# EAGLE design uno_bt (EAGLE 9.5.0)
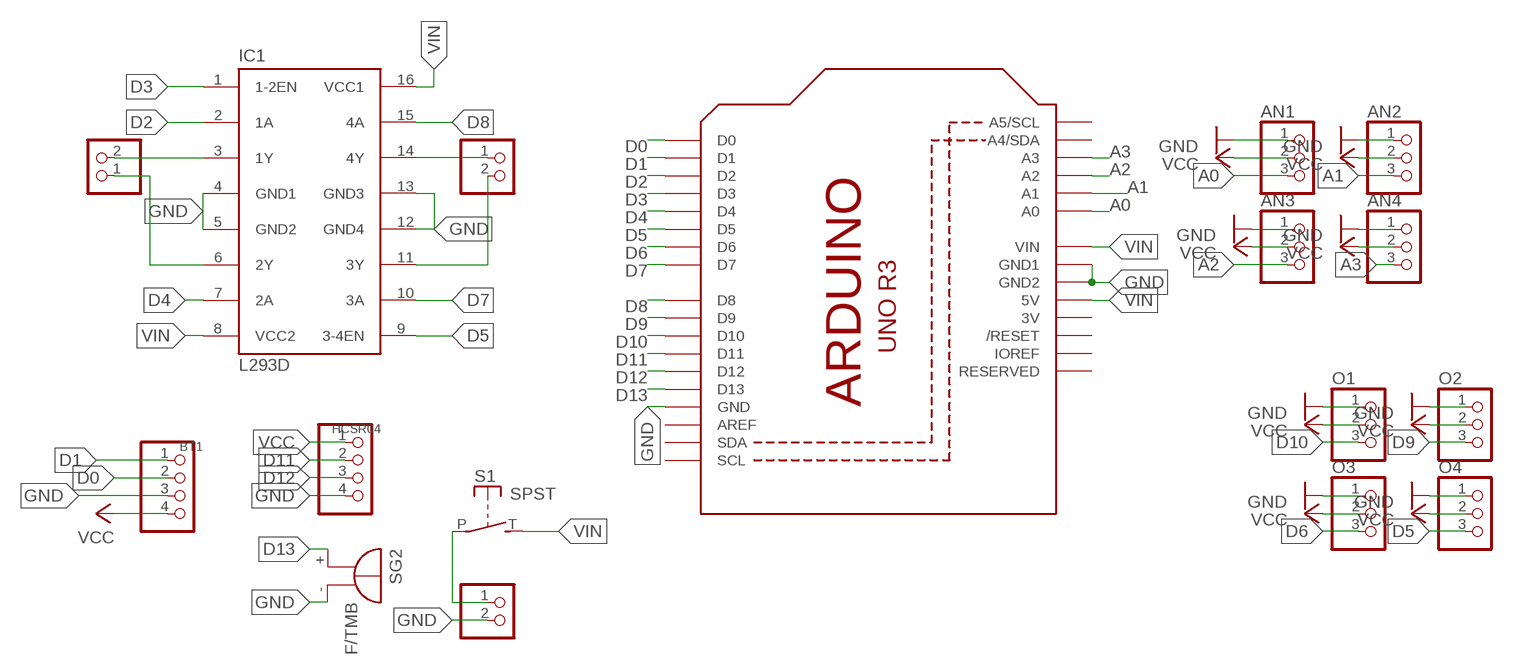
[diagram p0: schematic, sheet 1]

## Parts
AN1  PINHD-1X3  [1X03]
AN2  PINHD-1X3  [1X03]
AN3  PINHD-1X3  [1X03]
AN4  PINHD-1X3  [1X03]
BT1  PINHD-1X4  [1X04]
DCIN  PINHD-1X2  [1X02]
HCSR04  PINHD-1X4  [1X04]
IC1  L293D  [DIL16]
MT1  PINHD-1X2  [1X02]
MT2  PINHD-1X2  [1X02]
O1  PINHD-1X3  [1X03]
O2  PINHD-1X3  [1X03]
O3  PINHD-1X3  [1X03]
O4  PINHD-1X3  [1X03]
S1  SPST  [JUDCOSPST]
SG2  F/TMB  [F/TMB]
U1  ARDUINOR3-BPLACE  [ARDUINOR3-BPLACE]

## Nets
A0: AN1.3 U1.A0
A1: AN2.3 U1.A1
A2: AN3.3 U1.A2
A3: AN4.3 U1.A3
D0: BT1.2 U1.D0
D1: BT1.1 U1.D1
D2: IC1.2(1A) U1.D2
D3: IC1.1(1-2EN) U1.D3
D4: IC1.7(2A) U1.D4
D5: IC1.9(3-4EN) O4.3 U1.D5
D6: O3.3 U1.D6
D7: IC1.10(3A) U1.D7
D8: IC1.15(4A) U1.D8
D9: O2.3 U1.D9
D10: O1.3 U1.D10
D11: HCSR04.2 U1.D11
D12: HCSR04.3 U1.D12
D13: SG2.+ U1.D13
GND: AN1.1 AN2.1 AN3.1 AN4.1 BT1.3 DCIN.2 HCSR04.4 IC1.4(GND1) IC1.5(GND2) IC1.12(GND4) IC1.13(GND3) O1.1 O2.1 O3.1 O4.1 SG2.- U1.GND U1.GND1 U1.GND2
N$1: IC1.3(1Y) MT1.2
N$2: IC1.6(2Y) MT1.1
N$3: IC1.14(4Y) MT2.1
N$4: IC1.11(3Y) MT2.2
N$5: DCIN.1 S1.P
VCC: AN1.2 AN2.2 AN3.2 AN4.2 BT1.4 HCSR04.1 O1.2 O2.2 O3.2 O4.2
VIN: IC1.8(VCC2) IC1.16(VCC1) S1.T(S) U1.5V U1.VIN
Unconnected: U1.A4(A4/SDA) U1.A5(A5/SCL) U1.AREF U1.IOREF U1.RESERVED U1.RESET(/RESET) U1.SCL U1.SDA

## Power pins joined to a net without a drawn wire
3V: U1.3V

## Library data of the parts
AN1-AN4 O1-O4 = adafruit:PINHD-1X3: PIN HEADER
BT1 HCSR04 = pinhead:PINHD-1X4: PIN HEADER
DCIN MT1 MT2 = pinhead:PINHD-1X2: PIN HEADER
IC1 = st-microelectronics:L293D: PUSH-PULL 4 CHANNEL DRIVER; MPN: L293D; OC_FARNELL: 9589619; OC_NEWARK: 56P8249
S1 = adafruit_arduino:SPST: Judco 50-0015-00
SG2 = buzzer:F/TMB: BUZZER Source: Buerklin; OC_FARNELL: unknown; OC_NEWARK: unknown
U1 = adafruit_arduino:ARDUINOR3: This is a new object for the new Arduino R3 - with extra pins that you may want to use (such as IOref, and duplicated A4/A5

## Board
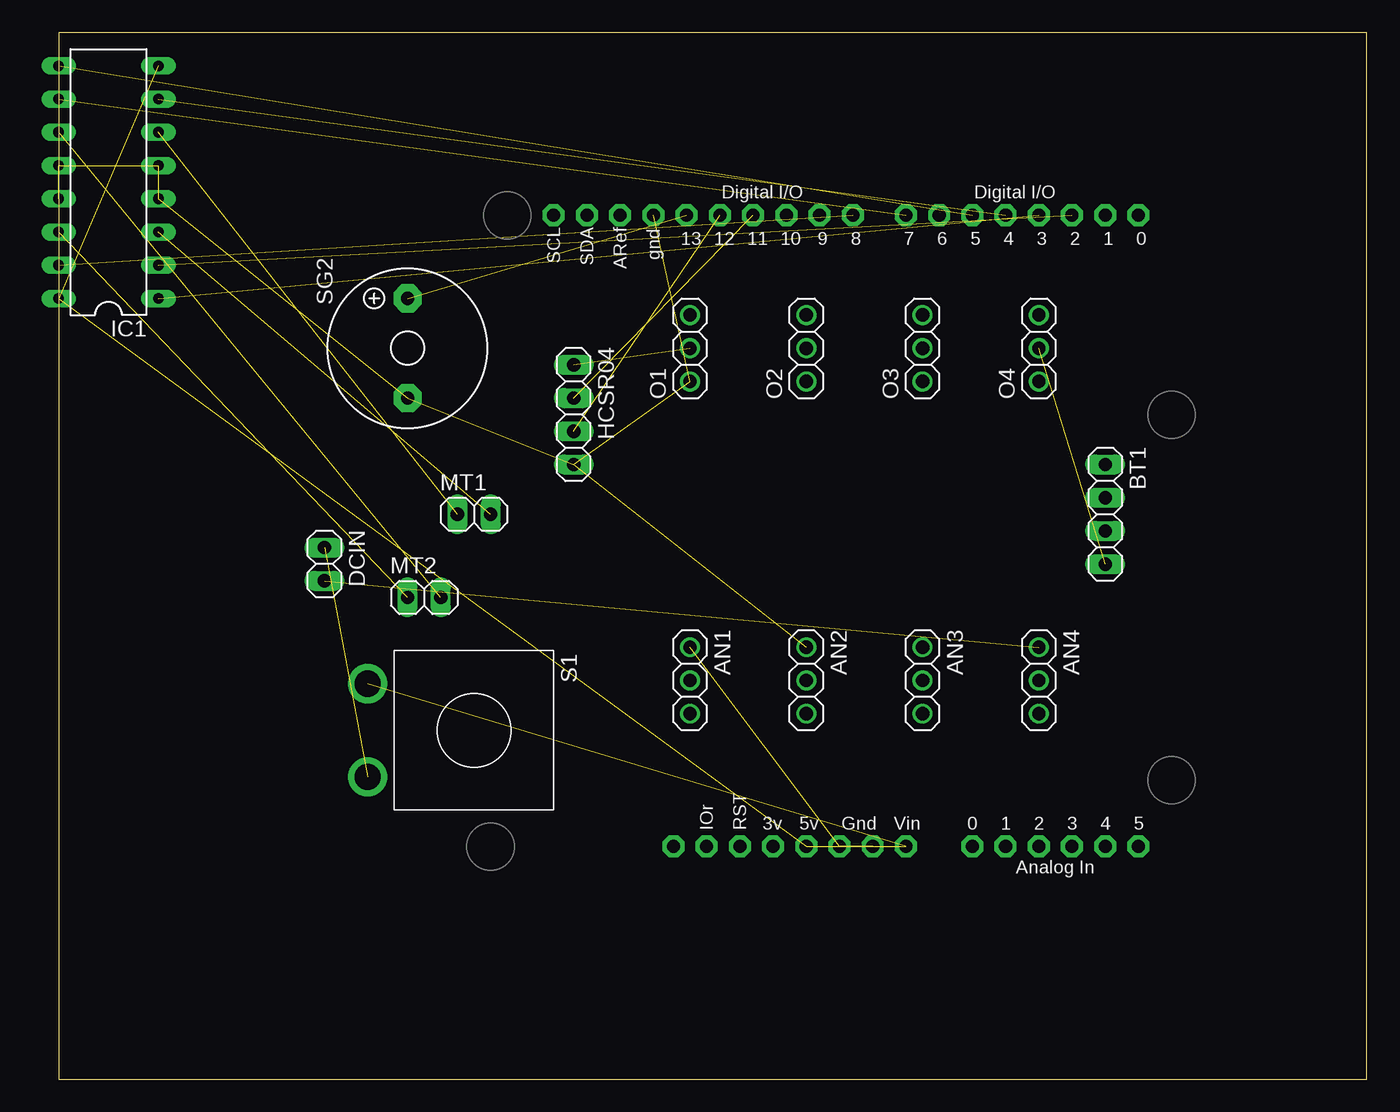
[diagram p1: board, top side]
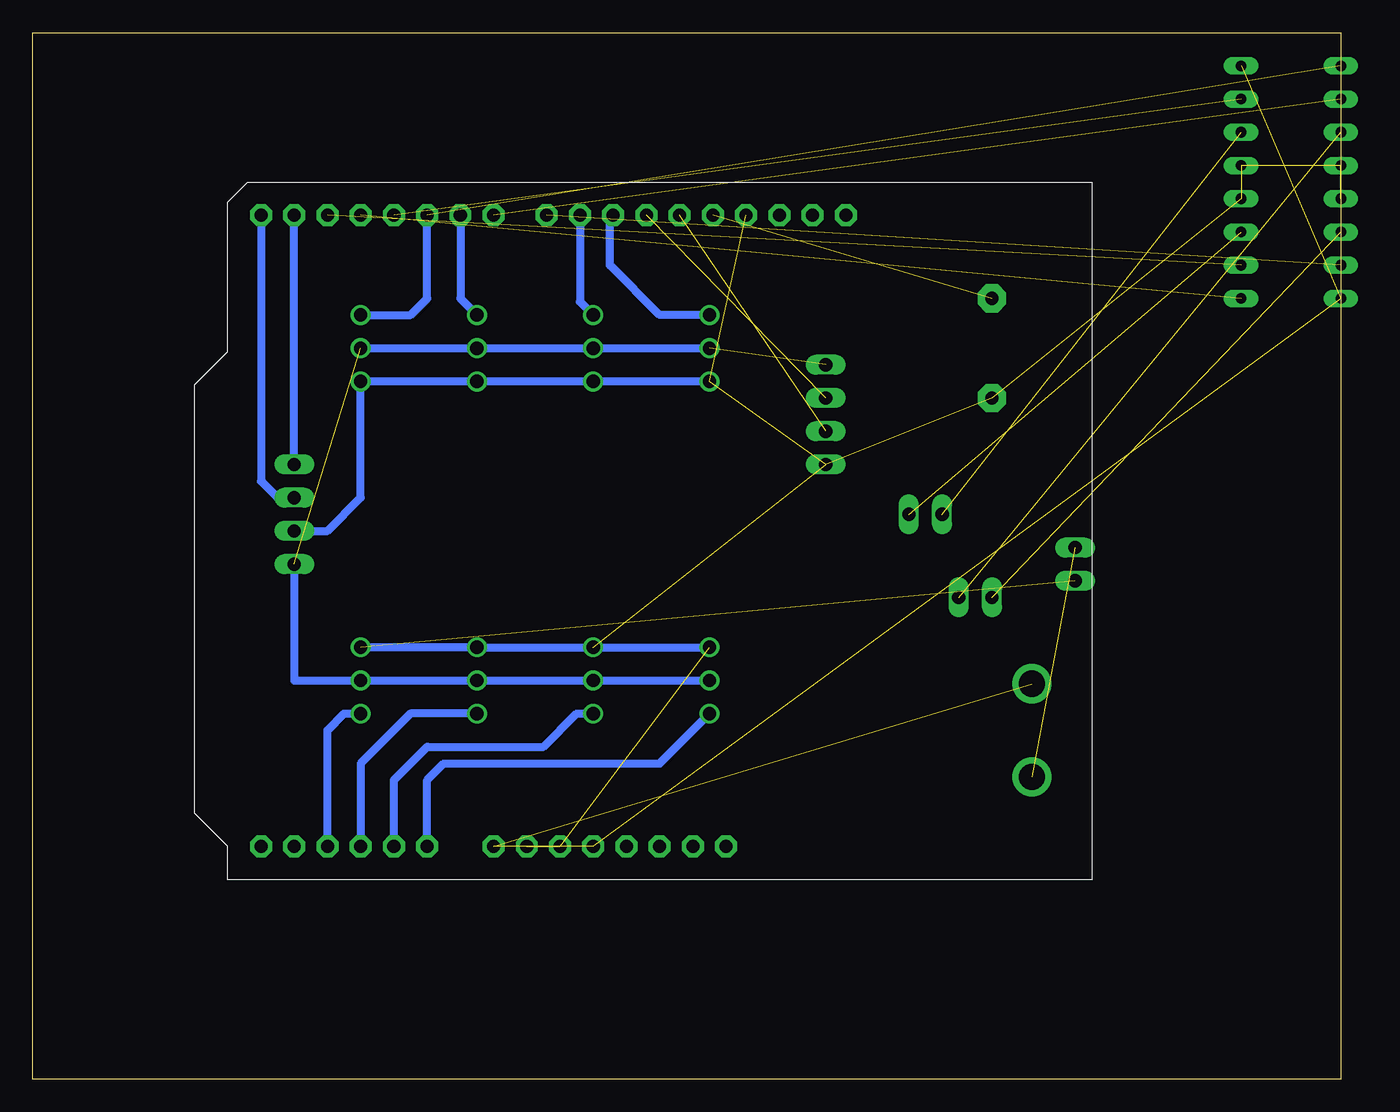
[diagram p2: board, bottom side, seen from below]

Size 100 x 80 mm. Coordinates in mm from the lower left corner, seen from the top.
Outline: 0,0 100,0 100,80 0,80 0,0
Copper layers (1*16): Top 0.035mm / dielectric 1.5mm / Bottom 0.035mm
Design rules "default": minimum track width 6mil, minimum drill 0.35mm, track to track 6mil, track to pad 6mil, pad to pad 6mil, via to via 6mil, smd to smd 6mil, copper to edge 40mil, drill to drill 6mil, minimum pad ring 10mil, minimum via ring 8mil, stop-mask expansion 4mil, vias tented up to drill 0mil, thermal gap 10mil

### Footprints (pad centres in the part's own frame; a part is rotated, then mirrored left to right if it is on the bottom)
1X03 = drill 1.016: 1 -2.54,0; 2 0,0; 3 2.54,0
1X04 = drill 1.016 long: 1 -3.81,0; 2 -1.27,0; 3 1.27,0; 4 3.81,0
1X02 = drill 1.016 long: 1 -1.27,0; 2 1.27,0
DIL16 = drill 0.813 long: 1 -8.89,-3.81; 2 -6.35,-3.81; 3 -3.81,-3.81; 4 -1.27,-3.81; 5 1.27,-3.81; 6 3.81,-3.81; 7 6.35,-3.81; 8 8.89,-3.81; 9 8.89,3.81; 10 6.35,3.81; 11 3.81,3.81; 12 1.27,3.81; 13 -1.27,3.81; 14 -3.81,3.81; 15 -6.35,3.81; 16 -8.89,3.81
JUDCOSPST = drill 2: P 3.556,-8.128; T -3.556,-8.128
F/TMB = drill 1.016 pad 2.159 octagon: + 3.81,0; - -3.81,0
ARDUINOR3-BPLACE = drill 1 pad 1.676 octagon: 3V 35.56,2.54; 5V 38.1,2.54; A0 50.8,2.54; A1 53.34,2.54; A2 55.88,2.54; A3 58.42,2.54; A4 60.96,2.54; A5 63.5,2.54; AREF 23.876,50.8; D0 63.5,50.8; D1 60.96,50.8; D2 58.42,50.8; D3 55.88,50.8; D4 53.34,50.8; D5 50.8,50.8; D6 48.26,50.8; D7 45.72,50.8; D8 41.656,50.8; D9 39.116,50.8; D10 36.576,50.8; D11 34.036,50.8; D12 31.496,50.8; D13 28.956,50.8; GND 26.416,50.8; GND1 43.18,2.54; GND2 40.64,2.54; IOREF 30.48,2.54; RESERVED 27.94,2.54; RESET 33.02,2.54; SCL 18.796,50.8; SDA 21.336,50.8; VIN 45.72,2.54

### Placement (x,y rotation side)
AN1  48.26,30.48 270 top
AN2  57.15,30.48 270 top
AN3  66.04,30.48 270 top
AN4  74.93,30.48 270 top
BT1  80.01,43.18 270 top
DCIN  20.32,39.37 270 top
HCSR04  39.37,50.8 270 top
IC1  3.81,68.58 90 top
MT1  31.75,43.18 0 top
MT2  27.94,36.83 0 top
O1  48.26,55.88 90 top
O2  57.15,55.88 90 top
O3  66.04,55.88 90 top
O4  74.93,55.88 90 top
S1  31.75,26.67 270 top
SG2  26.67,55.88 90 top
U1  19.05,15.24 0 top

### Tracks (layer width: path | path; a pad name or v marks a point on that pad's centre or on a via)
A0
  Bottom 0.61: U1.A0 69.85,22.86 68.58,24.13 52.07,24.13 AN1.3
A1
  Bottom 0.61: U1.A1 72.39,22.86 69.85,25.4 60.96,25.4 58.42,27.94 AN2.3
A2
  Bottom 0.61: AN3.3 71.12,27.94 74.93,24.13 U1.A2
A3
  Bottom 0.61: U1.A3 77.47,26.67 76.2,27.94 AN4.3
D0
  Bottom 0.61: U1.D0 82.55,45.72 81.28,44.45 BT1.2
D1
  Bottom 0.61: BT1.1 U1.D1
D2  (1 unrouted)
D3  (1 unrouted)
D4  (1 unrouted)
D5  (1 unrouted)
  Bottom 0.61: O4.3 71.12,58.42 69.85,59.69 U1.D5
D6
  Bottom 0.61: U1.D6 67.31,59.69 O3.3
D7  (1 unrouted)
D8  (1 unrouted)
D9
  Bottom 0.61: U1.D9 58.17,59.44 O2.3
D10
  Bottom 0.61: U1.D10 55.88,65.79 55.88,62.23 52.07,58.42 O1.3
D11  (1 unrouted)
D12  (1 unrouted)
D13  (1 unrouted)
GND  (11 unrouted)
  Bottom 0.61: O1.1 O2.1 O3.1 O4.1 74.93,44.45 77.47,41.91 BT1.3 | AN1.1 AN2.1 AN3.1 AN4.1
N$1  (1 unrouted)
N$2  (1 unrouted)
N$3  (1 unrouted)
N$4  (1 unrouted)
N$5  (1 unrouted)
VCC  (2 unrouted)
  Bottom 0.61: O4.2 O3.2 O2.2 O1.2 | BT1.4 80.01,30.48 AN4.2 AN3.2 AN2.2 AN1.2
VIN  (4 unrouted)